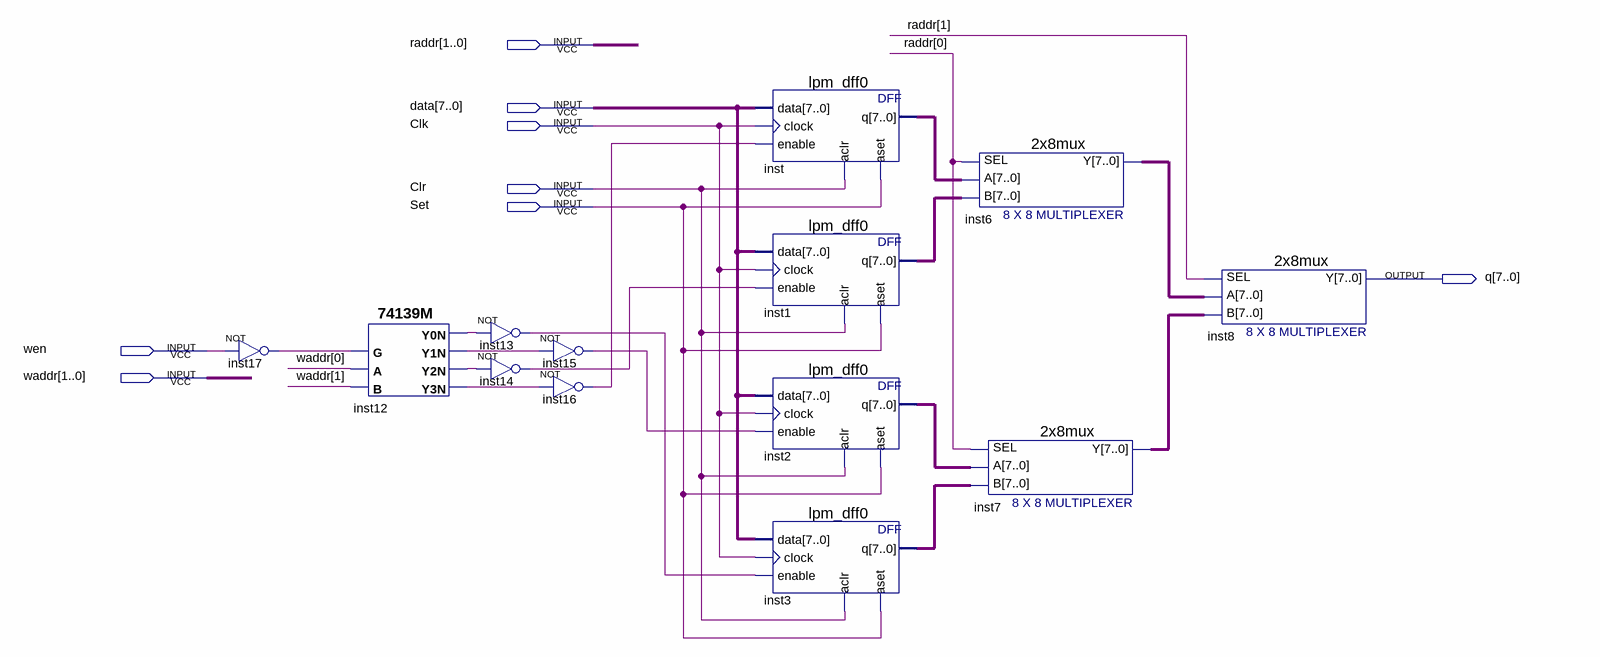
[diagram p0: schematic sheet]
// Quartus schematic EX_1.bdf as structural Verilog: 13 symbols, 8 pins
module EX_1 (
  input  [1:0] raddr,
  input  [7:0] data,
  input  Clk,
  input  Clr,
  input  Set,
  input  wen,
  input  [1:0] waddr,
  output [7:0] q
);

  wire inst12_y0n, inst12_y1n, inst12_y2n, inst12_y3n, inst13_out, inst14_out, inst15_out, inst16_out,
       inst17_out;
  wire [7:0] inst1_q, inst2_q, inst3_q, inst6_y, inst7_y, inst_q;

  not inst17 (inst17_out, wen);
  \74139M  inst12 (
    .B(waddr[1]), .A(waddr[0]), .G(inst17_out), .Y3N(inst12_y3n), .Y2N(inst12_y2n), .Y0N(inst12_y0n),
    .Y1N(inst12_y1n));
  not inst13 (inst13_out, inst12_y0n);
  not inst14 (inst14_out, inst12_y2n);
  not inst15 (inst15_out, inst12_y1n);
  not inst16 (inst16_out, inst12_y3n);
  lpm_dff0 inst (.data(data), .clock(Clk), .enable(inst16_out), .aclr(Clr), .aset(Set), .q(inst_q));
  lpm_dff0 inst1 (.data(data), .clock(Clk), .enable(inst14_out), .aclr(Clr), .aset(Set), .q(inst1_q));
  lpm_dff0 inst2 (.data(data), .clock(Clk), .enable(inst15_out), .aclr(Clr), .aset(Set), .q(inst2_q));
  lpm_dff0 inst3 (.data(data), .clock(Clk), .enable(inst13_out), .aclr(Clr), .aset(Set), .q(inst3_q));
  \2x8mux  inst6 (.SEL(raddr[0]), .A(inst_q), .B(inst1_q), .Y(inst6_y));
  \2x8mux  inst7 (.SEL(raddr[0]), .A(inst2_q), .B(inst3_q), .Y(inst7_y));
  \2x8mux  inst8 (.SEL(raddr[1]), .A(inst6_y), .B(inst7_y), .Y(q));
endmodule
